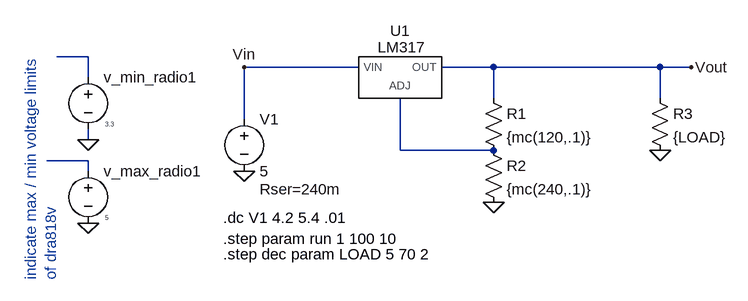
[diagram p0: schematic Draft1.asc]
Draft1.asc, the LTspice schematic file:
Version 4
SHEET 1 880 680
WIRE -320 16 -368 16
WIRE 96 32 -80 32
WIRE 304 32 224 32
WIRE 560 32 304 32
WIRE 608 32 560 32
WIRE -320 48 -320 16
WIRE 304 80 304 32
WIRE 560 80 560 32
WIRE -80 112 -80 32
WIRE -320 144 -320 128
WIRE 160 160 160 80
WIRE 304 160 160 160
WIRE -320 176 -384 176
WIRE -320 192 -320 176
FLAG -80 192 0
FLAG 304 240 0
FLAG 560 160 0
FLAG -80 32 Vin
FLAG 608 32 Vout
FLAG -320 272 0
FLAG -320 144 0
SYMBOL voltage -80 96 R0
WINDOW 123 0 0 Left 0
WINDOW 39 24 124 Left 2
SYMATTR SpiceLine Rser=240m
SYMATTR InstName V1
SYMATTR Value 5
SYMBOL res 288 64 R0
SYMATTR InstName R1
SYMATTR Value {mc(120,.1)}
SYMBOL res 288 144 R0
SYMATTR InstName R2
SYMATTR Value {mc(240,.1)}
SYMBOL LM317 160 32 R0
SYMATTR InstName U1
SYMBOL res 544 64 R0
SYMATTR InstName R3
SYMATTR Value {LOAD}
SYMBOL voltage -320 32 R0
WINDOW 3 26 88 Left 0
WINDOW 123 0 0 Left 0
WINDOW 39 0 0 Left 0
SYMATTR Value 3.3
SYMATTR InstName v_min_radio1
SYMBOL voltage -320 176 R0
WINDOW 3 26 88 Left 0
WINDOW 123 0 0 Left 0
WINDOW 39 0 0 Left 0
SYMATTR Value 5
SYMATTR InstName v_max_radio1
TEXT -112 264 Left 2 !.dc V1 4.2 5.4 .01
TEXT -112 296 Left 2 !.step param run 1 100 10
TEXT -112 320 Left 2 !.step dec param LOAD 5 70 2
TEXT -408 360 VLeft 2 ;indicate max / min voltage limits\nof dra818v

The netlist it stands for:
* Draft1.asc
V1 Vin 0 5 Rser=240m
R1 Vout N002 {mc(120,.1)}
R2 N002 0 {mc(240,.1)}
XU1 Vin N002 Vout LM317  ; pins VIN ADJ OUT
R3 Vout 0 {LOAD}
v_min_radio1 N001 0 3.3
v_max_radio1 N003 0 5
.dc V1 4.2 5.4 .01
.step param run 1 100 10
.step dec param LOAD 5 70 2
* indicate max / min voltage limits
* of dra818v
.lib C:\Users\Giselle\Desktop\classes\ecen 2440\ECEN2440-final-project\ltspice\LM317\LM317.sub.txt
.backanno
.end